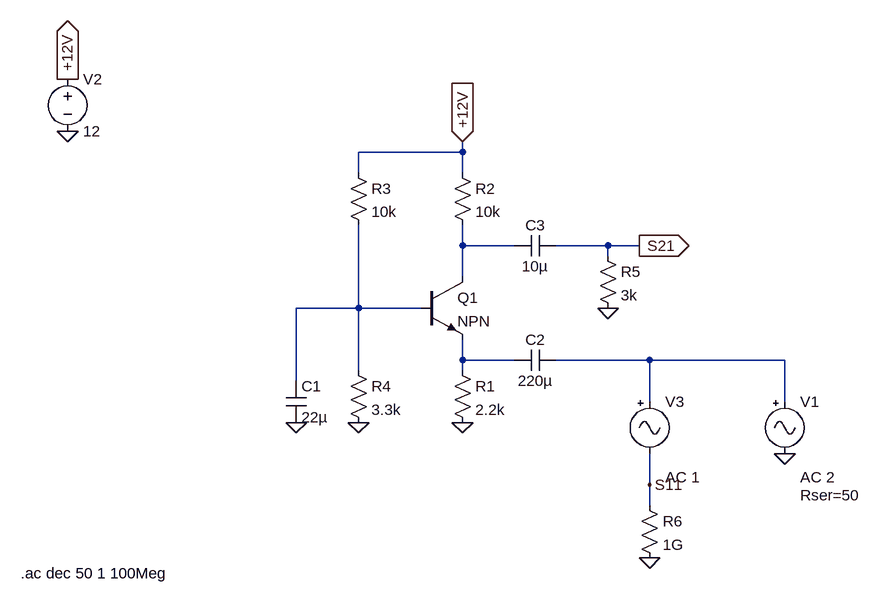
[diagram p0: schematic Common Base Amp.asc]
Common Base Amp.asc, the LTspice schematic file:
Version 4
SHEET 1 880 696
WIRE 192 32 192 16
WIRE 192 32 32 32
WIRE 32 64 32 32
WIRE 192 64 192 32
WIRE 192 176 192 144
WIRE 272 176 192 176
WIRE 416 176 336 176
WIRE 464 176 416 176
WIRE 416 192 416 176
WIRE 192 224 192 176
WIRE 32 272 32 144
WIRE 32 272 -64 272
WIRE 128 272 32 272
WIRE 192 352 192 320
WIRE 272 352 192 352
WIRE 480 352 336 352
WIRE 688 352 480 352
WIRE 32 368 32 272
WIRE 192 368 192 352
WIRE -64 384 -64 272
WIRE 480 416 480 352
WIRE 688 416 688 352
WIRE 480 544 480 496
WIRE 480 576 480 544
FLAG -416 0 0
FLAG -416 -80 +12V
IOPIN -416 -80 Out
FLAG 192 16 +12V
IOPIN 192 16 In
FLAG 192 448 0
FLAG 32 448 0
FLAG -64 448 0
FLAG 688 496 0
FLAG 416 272 0
FLAG 480 656 0
FLAG 480 544 S11
FLAG 464 176 S21
IOPIN 464 176 Out
SYMBOL npn 128 224 R0
SYMATTR InstName Q1
SYMBOL res 176 352 R0
SYMATTR InstName R1
SYMATTR Value 2.2k
SYMBOL res 176 48 R0
SYMATTR InstName R2
SYMATTR Value 10k
SYMBOL res 16 48 R0
SYMATTR InstName R3
SYMATTR Value 10k
SYMBOL res 16 352 R0
SYMATTR InstName R4
SYMATTR Value 3.3k
SYMBOL cap -80 384 R0
SYMATTR InstName C1
SYMATTR Value 22µ
SYMBOL cap 336 336 R90
WINDOW 0 0 32 VBottom 0
WINDOW 3 32 32 VTop 0
SYMATTR InstName C2
SYMATTR Value 220µ
SYMBOL cap 336 160 R90
WINDOW 0 0 32 VBottom 0
WINDOW 3 32 32 VTop 0
SYMATTR InstName C3
SYMATTR Value 10µ
SYMBOL Misc\\signal 688 400 R0
WINDOW 123 24 132 Left 0
WINDOW 39 24 160 Left 0
SYMATTR Value2 AC 2
SYMATTR SpiceLine Rser=50
SYMATTR InstName V1
SYMATTR Value ""
SYMBOL voltage -416 -96 R0
WINDOW 123 0 0 Left 0
WINDOW 39 0 0 Left 0
SYMATTR InstName V2
SYMATTR Value 12
SYMBOL res 400 176 R0
SYMATTR InstName R5
SYMATTR Value 3k
SYMBOL Misc\\signal 480 400 R0
WINDOW 123 24 132 Left 0
WINDOW 39 24 160 Left 0
SYMATTR Value2 AC 1
SYMATTR InstName V3
SYMATTR Value ""
SYMBOL res 464 560 R0
SYMATTR InstName R6
SYMATTR Value 1G
TEXT -488 680 Left 0 !.ac dec 50 1 100Meg

The netlist it stands for:
* Common Base Amp.asc
Q1 N001 N002 N003 0 NPN
R1 N003 0 2.2k
R2 +12V N001 10k
R3 +12V N002 10k
R4 N002 0 3.3k
C1 N002 0 22µ
C2 N004 N003 220µ
C3 S21 N001 10µ
V1 N004 0 AC 2 Rser=50
V2 +12V 0 12
R5 S21 0 3k
V3 N004 S11 AC 1
R6 S11 0 1G
.model NPN NPN
.model PNP PNP
.lib standard.bjt
.ac dec 50 1 100Meg
.backanno
.end

* Results of the author's LTspice run, read from the files saved beside the schematic
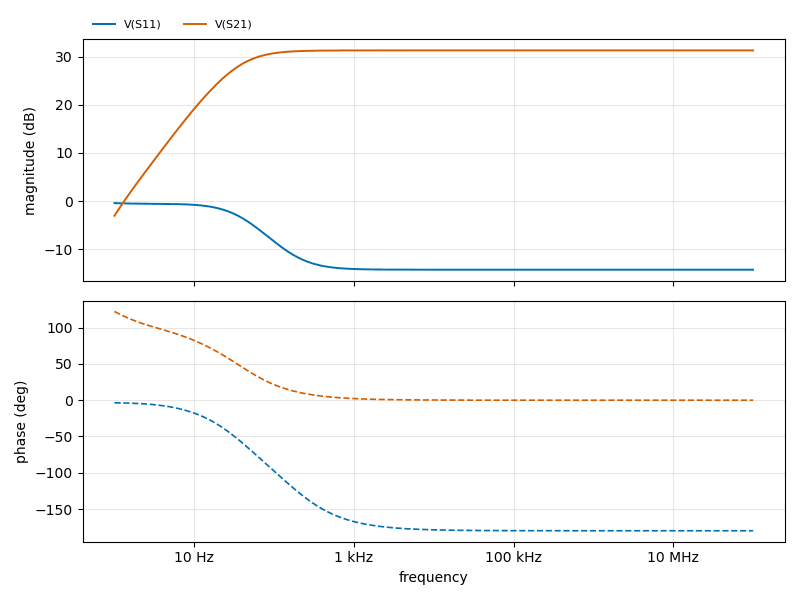
[diagram p1: AC Analysis of Common Base Amp.asc, plotted from the saved traces]
* AC Analysis, 1 run:
*   V(S11): -0.43 dB at 1 Hz, -14.25 dB at 100 MHz, peak -0.43 dB at 1 Hz, 3 dB below the peak at 38.92 Hz
*   V(S21): -3.04 dB at 1 Hz, 31.27 dB at 100 MHz, peak 31.27 dB at 100 MHz, 3 dB below the peak at 37.97 Hz